# Altium schematic sheet power_supplies_HVAMP.SchDoc: HVAMP
size 420 x 297 mm; Author: G.Kasprowicz; CompanyName: WUT ISE; DrawnBy: G.Kasprowicz; Organization: WUT ISE; Address1: PW ISE; Address2: Nowowiejska 15/19 00-665 Warsaw; Address3: gkasprow@gmail.com; DocumentNumber: 4; Revision: 2; SheetNumber: 12; SheetTotal: 12; ModifiedBy: -; CheckedDate: -; Title2: Power supply; DivGrp: WUT ISE; Designer: G.Kasprowicz; ModifiedDate: -; ProjectName: Sensor Box
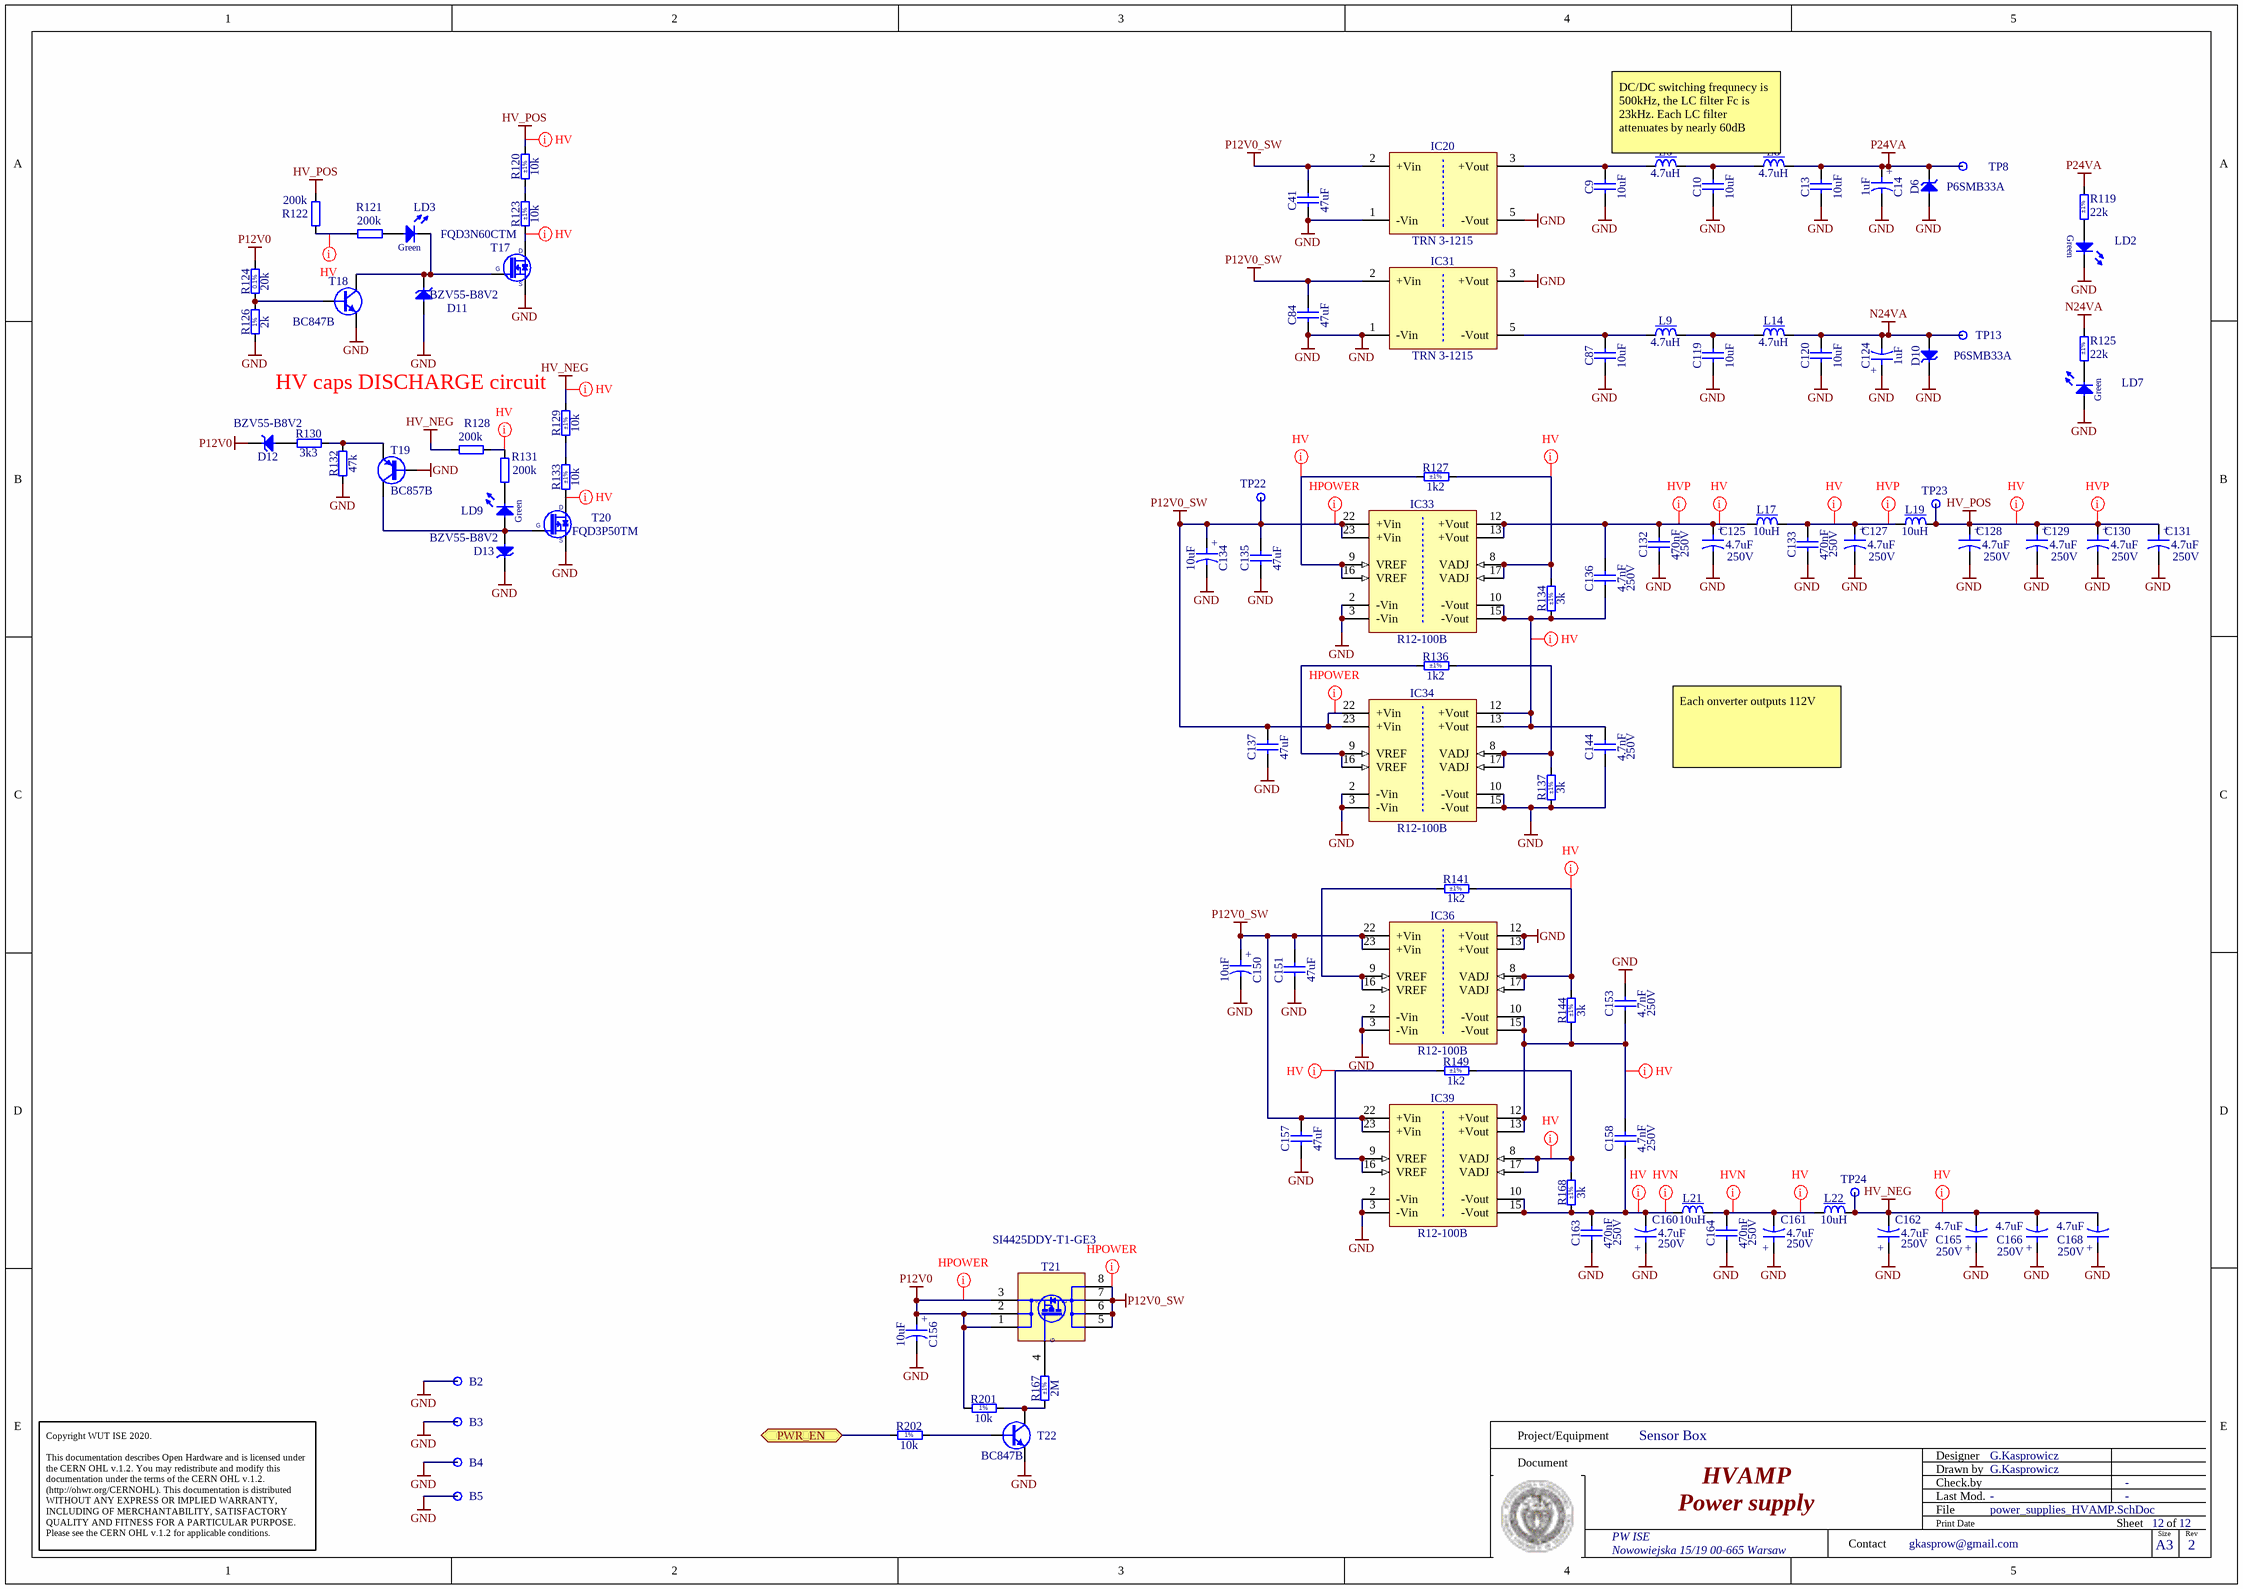
[diagram p0: power_supplies_HVAMP.SchDoc]

## Parts
B2  Plated Hole  [MTG320_700]  (value not drawn)  (no BOM)
B3  Plated Hole  [MTG320_700]  (value not drawn)  (no BOM)
B4  Plated Hole  [MTG320_700]  (value not drawn)  (no BOM)
B5  Plated Hole  [MTG320_700]  (value not drawn)  (no BOM)
C9  10uF  [CAPC2012X145N]
C10  10uF  [CAPC2012X145N]
C13  10uF  [CAPC2012X145N]
C14  1uF  [CAPMP3216X180N]
C41  47uF  [CAPC3225X270N]
C84  47uF  [CAPC3225X270N]
C87  10uF  [CAPC2012X145N]
C119  10uF  [CAPC2012X145N]
C120  10uF  [CAPC2012X145N]
C124  1uF  [CAPMP3216X180N]
C125  4.7uF  Voltage: 250V  [CAPAE9383X100M]
C127  4.7uF  Voltage: 250V  [CAPAE9383X100M]
C128  4.7uF  Voltage: 250V  [CAPAE9383X100M]
C129  4.7uF  Voltage: 250V  [CAPAE9383X100M]
C130  4.7uF  Voltage: 250V  [CAPAE9383X100M]
C131  4.7uF  Voltage: 250V  [CAPAE9383X100M]
C132  470nF  Voltage: 250V  [CAPC4532X185N]
C133  470nF  Voltage: 250V  [CAPC4532X185N]
C134  10uF  [CAPMP6032X280N]
C135  47uF  [CAPC3225X270N]
C136  4.7nF  Voltage: 250V  [CAPC2012X135N]
C137  47uF  [CAPC3225X270N]
C144  4.7nF  Voltage: 250V  [CAPC2012X135N]
C150  10uF  [CAPMP6032X280N]
C151  47uF  [CAPC3225X270N]
C153  4.7nF  Voltage: 250V  [CAPC2012X135N]
C156  10uF  [CAPMP6032X280N]
C157  47uF  [CAPC3225X270N]
C158  4.7nF  Voltage: 250V  [CAPC2012X135N]
C160  4.7uF  Voltage: 250V  [CAPAE9383X100M]
C161  4.7uF  Voltage: 250V  [CAPAE9383X100M]
C162  4.7uF  Voltage: 250V  [CAPAE9383X100M]
C163  470nF  Voltage: 250V  [CAPC4532X185N]
C164  470nF  Voltage: 250V  [CAPC4532X185N]
C165  4.7uF  Voltage: 250V  [CAPAE9383X100M]
C166  4.7uF  Voltage: 250V  [CAPAE9383X100M]
C168  4.7uF  Voltage: 250V  [CAPAE9383X100M]
D6  P6SMB33A  [DIOM5436X261N]
D10  P6SMB33A  [DIOM5436X261N]
D11  BZV55-B8V2  [DIOMELF3515N]
D12  BZV55-B8V2  [DIOMELF3515N]
D13  BZV55-B8V2  [DIOMELF3515N]
IC20  TRN 3-1215  [DCDC_TRACO_TRN3]
IC31  TRN 3-1215  [DCDC_TRACO_TRN3]
IC33  R12-100B  [DCDC_RECOM_Rxx-B]
IC34  R12-100B  [DCDC_RECOM_Rxx-B]
IC36  R12-100B  [DCDC_RECOM_Rxx-B]
IC39  R12-100B  [DCDC_RECOM_Rxx-B]
L6  4.7uH  [INDC2012X145N]
L8  4.7uH  [INDC2012X145N]
L9  4.7uH  [INDC2012X145N]
L14  4.7uH  [INDC2012X145N]
L17  10uH  [IND_MURATA-PS_8400]
L19  10uH  [IND_MURATA-PS_8400]
L21  10uH  [IND_MURATA-PS_8400]
L22  10uH  [IND_MURATA-PS_8400]
LD2  Green  [LED_KINGBRIGHT_KPH-1608CGCKr]  (value not drawn)
LD3  Green  [LED_KINGBRIGHT_KPH-1608CGCKr]  (value not drawn)
LD7  Green  [LED_KINGBRIGHT_KPH-1608CGCKr]  (value not drawn)
LD9  Green  [LED_KINGBRIGHT_KPH-1608CGCKr]  (value not drawn)
R119  22k  Tolerance: ±1%  [RESC1005X40N]
R120  10k  Tolerance: ±1%  [RESC3216X65N]
R121  200k  [RESC3216X65N]
R122  200k  [RESC3216X65N]
R123  10k  Tolerance: ±1%  [RESC3216X65N]
R124  20k  [RESC1608X55N]
R125  22k  Tolerance: ±1%  [RESC1005X40N]
R126  2k  [RESC1005X40N]
R127  1k2  Tolerance: ±1%  [RESC1608X55N]
R128  200k  [RESC3216X65N]
R129  10k  Tolerance: ±1%  [RESC3216X65N]
R130  3k3  [RESC1005X40N]
R131  200k  [RESC3216X65N]
R132  47k  [RESC1608X55N]
R133  10k  Tolerance: ±1%  [RESC3216X65N]
R134  3k  Tolerance: ±1%  [RESC1608X55N]
R136  1k2  Tolerance: ±1%  [RESC1608X55N]
R137  3k  Tolerance: ±1%  [RESC1608X55N]
R141  1k2  Tolerance: ±1%  [RESC1608X55N]
R144  3k  Tolerance: ±1%  [RESC1608X55N]
R149  1k2  Tolerance: ±1%  [RESC1608X55N]
R167  2M  Tolerance: ±1%  [RESC1005X40N]
R168  3k  Tolerance: ±1%  [RESC1608X55N]
R201  10k  [RESC1005X40N]
R202  10k  [RESC1005X40N]
T17  FQD3N60CTM  [TO228P991X239-3N-R552X520]
T18  BC847B  [SOT95P230X110-3N]
T19  BC857B  [SOT95P230X110-3N]
T20  FQD3P50TM  [TO228P991X239-3N-R552X520]
T21  SI4425DDY-T1-GE3  [SOIC127P600X175-8N]
T22  BC847B  [SOT95P230X110-3N]
TP8  Test Point  [TPS127]  (value not drawn)
TP13  Test Point  [TPS127]  (value not drawn)
TP22  Test Point  [TPS127]  (value not drawn)
TP23  Test Point  [TPS127]  (value not drawn)
TP24  Test Point  [TPS127]  (value not drawn)

## Ports
PWR_EN (bidir)

## Nets
GND: B2.1 B3.1 B4.1 B5.1 C9.1 C10.1 C13.1 C14.2 C41.1 C84.1 C87.1 C119.1 C120.1 C124.1 C125.2 C127.2 C128.2 C129.2 C130.2 C131.2 C132.1 C133.1 C134.2 C135.1 C137.1 C144.1 C150.2 C151.1 C153.2 C156.2 C157.1 C160.1 C161.1 C162.1 C163.1 C164.1 C165.1 C166.1 C168.1 D6.2(A) D10.1(C) D11.2(A) D13.1(C) IC20.1(-Vin) IC20.5(-Vout) IC31.1(-Vin) IC31.3(+Vout) IC33.2(-Vin) IC33.3(-Vin) IC34.2(-Vin) IC34.3(-Vin) IC34.10(-Vout) IC34.15(-Vout) IC36.2(-Vin) IC36.3(-Vin) IC36.12(+Vout) IC36.13(+Vout) IC39.2(-Vin) IC39.3(-Vin) LD2.1(C) LD7.2(A) R126.1 R132.1 R137.1 T17.2(S) T18.2(E) T19.1(B) T20.2(S) T22.2(E)
HV_NEG: C162.2 C165.2 C166.2 C168.2 L22.2 R128.1 R129.2 TP24.1
HV_POS: C128.1 C129.1 C130.1 C131.1 L19.2 R120.2 R122.2 TP23.1
N24VA: C120.2 C124.2 D10.2(A) L14.2 R125.2 TP13.1
P12V0: C156.1 D12.1(C) R124.2 R201.1 T21.1(S) T21.2(S) T21.3(S)
P12V0_SW: C41.2 C84.2 C134.1 C135.2 C137.2 C150.1 C151.2 C157.2 IC20.2(+Vin) IC31.2(+Vin) IC33.22(+Vin) IC33.23(+Vin) IC34.22(+Vin) IC34.23(+Vin) IC36.22(+Vin) IC36.23(+Vin) IC39.22(+Vin) IC39.23(+Vin) T21.5(D) T21.6(D) T21.7(D) T21.8(D) TP22.1
P24VA: C13.2 C14.1 D6.1(C) L8.2 R119.2 TP8.1
PWR_EN: R202.1 ; port PWR_EN
NetC9_2: C9.2 IC20.3(+Vout) L6.1
NetC10_2: C10.2 L6.2 L8.1
NetC87_2: C87.2 IC31.5(-Vout) L9.1
NetC119_2: C119.2 L9.2 L14.1
NetC125_1: C125.1 C132.2 C136.2 IC33.12(+Vout) IC33.13(+Vout) L17.1
NetC127_1: C127.1 C133.2 L17.2 L19.1
NetC136_1: C136.1 C144.2 IC33.10(-Vout) IC33.15(-Vout) IC34.12(+Vout) IC34.13(+Vout) R134.1
NetC153_1: C153.1 C158.2 IC36.10(-Vout) IC36.15(-Vout) IC39.12(+Vout) IC39.13(+Vout) R144.1
NetC158_1: C158.1 C160.2 C163.2 IC39.10(-Vout) IC39.15(-Vout) L21.1 R168.1
NetC161_2: C161.2 C164.2 L21.2 L22.1
NetD11_1: D11.1(C) LD3.1(C) T17.1(G) T18.3(C)
NetD12_2: D12.2(A) R130.1
NetD13_2: D13.2(A) LD9.2(A) T19.3(C) T20.1(G)
NetIC33_8: IC33.8(VADJ) IC33.17(VADJ) R127.2 R134.2
NetIC33_9: IC33.9(VREF) IC33.16(VREF) R127.1
NetIC34_8: IC34.8(VADJ) IC34.17(VADJ) R136.2 R137.2
NetIC34_9: IC34.9(VREF) IC34.16(VREF) R136.1
NetIC36_8: IC36.8(VADJ) IC36.17(VADJ) R141.2 R144.2
NetIC36_9: IC36.9(VREF) IC36.16(VREF) R141.1
NetIC39_8: IC39.8(VADJ) IC39.17(VADJ) R149.2 R168.2
NetIC39_9: IC39.9(VREF) IC39.16(VREF) R149.1
NetLD2_2: LD2.2(A) R119.1
NetLD3_2: LD3.2(A) R121.1
NetLD7_1: LD7.1(C) R125.1
NetLD9_1: LD9.1(C) R131.2
NetR120_1: R120.1 R123.2
NetR121_2: R121.2 R122.1
NetR123_1: R123.1 T17.3(D)
NetR124_1: R124.1 R126.2 T18.1(B)
NetR128_2: R128.2 R131.1
NetR129_1: R129.1 R133.2
NetR130_2: R130.2 R132.2 T19.2(E)
NetR133_1: R133.1 T20.3(D)
NetR167_1: R167.1 R201.2 T22.3(C)
NetR167_2: R167.2 T21.4(S)
NetR202_2: R202.2 T22.1(B)

## Layout directives
net class Hpower: P12V0, P12V0_SW
net class HV: HV_NEG, HV_POS, NetC125_1, NetC127_1, NetC136_1, NetC153_1, NetC158_1, NetC161_2, NetIC33_8, NetIC33_9, NetIC36_8, NetIC39_8, NetIC39_9, NetR121_2, NetR123_1, NetR128_2, NetR133_1
net class HVP: HV_POS, NetC125_1, NetC127_1
net class HVN: NetC158_1, NetC161_2

## Notes on the sheet
- DC/DC switching frequnecy is 500kHz, the LC filter Fc is 23kHz. Each LC filter attenuates by nearly 60dB
- (near R129) HV caps DISCHARGE circuit
- Each onverter outputs 112V
- Project/Equipment
- Document
- Designer
- Drawn by
- Check.by
- Copyright WUT ISE 2020.
  This documentation describes Open Hardware and is licensed under the CERN OHL v.1.2. You may redistribute and modify this documentation under the terms of the CERN OHL v.1.2. (http://ohwr.org/CERNOHL). This documentation is distributed WITHOUT ANY EXPRESS OR IMPLIED WARRANTY, INCLUDING OF MERCHANTABILITY, SATISFACTORY QUALITY AND FITNESS FOR A PARTICULAR PURPOSE. Please see the CERN OHL v.1.2 for applicable conditions.
- Contact
- File
- Last Mod.
- Print Date
- Sheet
- Size
- A3
- of
- Rev
- (in symbol CAP_ELECTRO_F_4.7u_250V) +
- (in symbol CTE3216-18_1UF_35V_10%) +
- (in symbol CTE6032-28_10UF_25V_10%_LESR0500) +
- (in symbol R0402_2K_1%_0.0625W_100PPM) 1%
- (in symbol R0402_10K_1%_0.0625W_100PPM) 1%
- (in symbol R0603_20K_0.1%_0.063W_10PPM) 0.1%
- (in symbol SI4425DDY-T1-GE3) G

## Library data of the parts
B2-B5 = PLATED_HOLE3.2_PAD7.0: Single Terminal Socket; Part Description: Plated Through Hole: Hole Dia.=3.2mm Pad Dia.=7.0mm; Mounted: No; Part Number: PLATED_HOLE3.2_PAD7.0; Component Type: Standard (No BOM); Pin Count: 1; Family: Plated Hole; Socket: No; SMD: No; Sense: No; Status: None; ComponentHeight: 0mm; HelpURL: Undefined; Author: CERN DEM JMW; CreateDate: 28.11.2017; LatestRevisionDate: 28.11.2017; PackageDescription: Plated Through Hole: Hole Dia.=3.2mm Pad Dia.=7.0mm
C9 C10 C13 C87 C119 C120 = CC0805_10UF_35V_10%_X5R_MURATA_GRM21BR6YA106KE43L: Non-polarised capacitor; Part Description: Chip Multilayer Ceramic Capacitor for General Purpose; Manufacturer: MURATA; Voltage: 35V; TC: X5R; Tolerance: ±10%; Part Number: CC0805_10UF_35V_10%_X5R_MURATA_GRM21BR6YA106KE43L; Component Kind: Standard; Component Type: Standard; Pin Count: 2; Value: 10uF; Status: Not Recommended; Manufacturer Part Number: GRM21BR6YA106KE43; Case: 0805; Mounted: Yes; Socket: No; SMD: Yes; Sense: No; ComponentHeight: 1.45mm; HelpURL: \\cern.ch\dfs\Applications\Altium\Datasheets\CC0805_MURATA_GRM21BR6YA106KE43L.pdf; Author: CERN DEM BC; CreateDate: 24.03.2020; LatestRevisionDate: 24.03.2020
C14 C124 = CTE3216-18_1UF_35V_10%: Polarised capacitor; Part Description: Solid Tantalum Chip Capacitor; Manufacturer: GENERIC; Manufacturer1 Part Number: TAJA105K035R; Voltage: 35V; Tolerance: ±10%; Part Number: CTE3216-18_1UF_35V_10%; Component Kind: Standard; Component Type: Standard; Pin Count: 2; Value: 1uF; Status: Preferred; Manufacturer Part Number: CTE3216-18_1UF_35V_10%; Case: A; Mounted: Yes; Socket: No; SMD: Yes; Sense: No; Manufacturer1 Example: AVX; Manufacturer1 ComponentHeight: 1.8mm; HelpURL: \\cern.ch\dfs\Applications\Altium\Datasheets\CTE_AVX_TAJ.pdf; Author: CERN DEM JLC; CreateDate: 03.12.2007; LatestRevisionDate: 03.12.2007
C41 C84 C135 C137 C151 C157 = CC1210_47UF_16V_20%_X5R: Non-polarised capacitor; Part Description: SMD Multilayer Chip Ceramic Capacitor; Manufacturer: GENERIC; Manufacturer1 Part Number: EMK325BJ476MM-T; Voltage: 16V; TC: X5R; Tolerance: ±20%; Part Number: CC1210_47UF_16V_20%_X5R; Component Kind: Standard; Component Type: Standard; Pin Count: 2; Value: 47uF; Status: None; Manufacturer Part Number: CC1210_47UF_16V_20%_X5R; Case: 1210; Mounted: Yes; Socket: No; SMD: Yes; Sense: No; Manufacturer1 Example: TAIYO YUDEN; Manufacturer1 ComponentHeight: 2.7mm; HelpURL: \\cern.ch\dfs\Applications\Altium\Datasheets\CC1210_X5R_TAIYO-YUDEN_HIGH-VALUE.pdf; Author: CERN DEM MR; CreateDate: 03.02.2016; LatestRevisionDate: 03.02.2016
C125 C127-C131 C160-C162 C165 C166 C168 = CAP_ELECTRO_F_4.7u_250V: Electrolytic capacitor 4.7uF 250V; Part Number: CAE800-1000_4.7UF_250V_20%; Part Description: Aluminum Electrolytic SMT Capacitor; Manufacturer: Nichicon; Manufacturer Part Number: UUX2E4R7MNL1GS; Tolerance: ±20%; Component Kind: Standard; Component Type: Standard; Pin Count: 2; Value: 4.7uF; Status: Recommended; Case: F; Mounted: Yes; Socket: No; SMD: Yes; Sense: No; ComponentHeight: 10.2mm; HelpURL: \\cern.ch\dfs\Applications\Altium\Datasheets\CAE_PANASONIC_FK.pdf; Author: GK; CreateDate: 03.12.2007; LatestRevisionDate: 05.11.2014
C132 C133 C163 C164 = CC1812_470NF_250V_10%_X7R_FT-CAP: Non-polarised capacitor; Part Description: Flexible Termination System (FT-CAP) SMD Multilayer Ceramic  Chip Capacitor; Manufacturer: KEMET; Manufacturer Part Number: C1812X474KARACTU; TC: X7R; Tolerance: ±10%; Part Number: CC1812_470NF_250V_10%_X7R_FT-CAP; Component Kind: Standard; Component Type: Standard; Pin Count: 2; Value: 470nF; Status: None; Case: 1812; Mounted: Yes; Socket: No; SMD: Yes; Sense: No; ComponentHeight: 1.85mm; HelpURL: \\cern.ch\dfs\Applications\Altium\Datasheets\CC1812_X7R_KEMET_FT-CAP.pdf; Author: CERN DEM JLC; CreateDate: 15.09.2014; LatestRevisionDate: 15.09.2014
C134 C150 C156 = CTE6032-28_10UF_25V_10%_LESR0500: Polarised capacitor; Part Description: Low ESR 0R5 Solid Tantalum Chip Capacitor; Manufacturer: GENERIC; Manufacturer1 Part Number: TPSC106K025R0500; Voltage: 25V; Tolerance: ±10%; Part Number: CTE6032-28_10UF_25V_10%_LESR0500; Component Kind: Standard; Component Type: Standard; Pin Count: 2; Value: 10uF; Status: Preferred; Manufacturer Part Number: CTE6032-28_10UF_25V_10%_LESR0500; Case: C; Mounted: Yes; Socket: No; SMD: Yes; Sense: No; Manufacturer1 Example: AVX; Manufacturer1 ComponentHeight: 2.8mm; HelpURL: \\cern.ch\dfs\Applications\Altium\Datasheets\CTE-LESR_AVX_TPS.pdf; Author: CERN DEM JLC; CreateDate: 05/05/2008; LatestRevisionDate: 20/01/2009
C136 C144 C153 C158 = CC0805_4.7NF_250V_10%_X7R: Non-polarised capacitor; Part Description: SMD Multilayer Chip Ceramic Capacitor; Manufacturer: GENERIC; Manufacturer1 Part Number: CC0805KRX7RYBB472; TC: X7R; Tolerance: ±10%; Part Number: CC0805_4.7NF_250V_10%_X7R; Component Kind: Standard; Component Type: Standard; Pin Count: 2; Value: 4.7nF; Status: None; Manufacturer Part Number: CC0805_4.7NF_250V_10%_X7R; Case: 0805; Mounted: Yes; Socket: No; SMD: Yes; Sense: No; Manufacturer1 Example: YAGEO PHYCOMP; Manufacturer1 ComponentHeight: 1.45mm; HelpURL: \\cern.ch\dfs\Applications\Altium\Datasheets\CC0805_NP0X7R_MID-VOLTAGE_100-to-630V.pdf; Author: CERN DEM MR; CreateDate: 16.02.2016; LatestRevisionDate: 16.02.2016
D6 D10 = P6SMB33A: Transient Voltage Suppressor Diode (Uni-Directional); Part Description: Uni-directional Transient Voltage Suppressor (TVS) Diode; Manufacturer: LITTELFUSE; Voltage: 33V; Power: 600W; PressFit: No; Bonding: No; Part Number: P6SMB33A; Component Kind: Standard; Component Type: Standard; Device: P6SMB33A; PackageDescription: DO-214-AA/SMB Diode, Molded Body; 5.40mm L X 3.62mm W X 2.61mm H, IPC Medium Density; Manufacturer Part Number: P6SMB33A; Pin Count: 2; Case: SMB; Mounted: Yes; Socket: No; SMD: Yes; Sense: No; ComponentHeight: 2.61mm; HelpURL: \\cern.ch\dfs\Applications\Altium\Datasheets\P6SMB33A.pdf; Author: CERN DEM JLC; CreateDate: 25.02.2019; LatestRevisionDate: 25.02.2019
D11-D13 = BZV55-B8V2: Zener Diode; Part Description: Voltage Regulator Diode; Manufacturer: NEXPERIA; Voltage: 8V2; Power: 500mW; PressFit: No; Bonding: No; Part Number: BZV55-B8V2; Component Kind: Standard; Component Type: Standard; Device: BZV55-B8V2; PackageDescription: SOD80C, MELF Diode, 2-Leads, Body 3.5x1.5mm, IPC Medium Density; Manufacturer Part Number: BZV55-B8V2; Pin Count: 2; Case: SOD-80C; Mounted: Yes; Socket: No; SMD: Yes; Sense: No; ComponentHeight: 1.6mm; HelpURL: \\cern.ch\dfs\Applications\Altium\Datasheets\BZV55.pdf; Author: CERN DEM JLC; CreateDate: 06.05.2008; LatestRevisionDate: 22.01.2018
IC20 IC31 = DCDC_TRACO_TRN 3-0515: 9-18V DC to 24V, Iout (max) 125mA, 3W DC-DC Converter; Part Description: 18-36VDC to 24V, Iout (max) 125mA, 3W DC-DC Converter; Manufacturer: TRACO POWER; PressFit: No; Bonding: No; Part Number: TRN 3-1215; Component Kind: Standard; Component Type: Standard; Device: TRN 3-1215; PackageDescription: TRN 3 Series , Body 11.9 x 7.7mm; Manufacturer Part Number: TRN 3-1215; Pin Count: 5; Mounted: Yes; Socket: No; SMD: No; Sense: No; ComponentHeight: 11.5mm; HelpURL: \\cern.ch\dfs\Applications\Altium\Datasheets\TRN 3-2411.pdf; Author: GK; CreateDate: 14.06.2018; LatestRevisionDate: 14.06.2018
IC33 IC34 IC36 IC39 = R12-100B: RECOM, Rxx-B Series, Single Output DCDC Converter; Part Description: 10-14VDC to 50-135VDC, 3kVDC Isolated, 5W DC-DC Converter; PressFit: No; Bonding: No; Part Number: R12-100B; Component Kind: Standard; Component Type: Standard; Device: R12-100B; PackageDescription: Rxx-B Series, Body 31.8x20.3mm, DIP24 Package; Manufacturer: RECOM; Manufacturer Part Number: R12-100B; Pin Count: 12; Mounted: Yes; Socket: No; SMD: No; Sense: No; ComponentHeight: 9.9mm; HelpURL: \\cern.ch\dfs\Applications\Altium\Datasheets\R12-100B.pdf; Author: CERN DEM MR; CreateDate: 29.08.2019; LatestRevisionDate: 29.08.2019
L6 L8 L9 L14 = IND0805_4.7UH_20%_TAIYO-YUDEN_CB: Inductor With Core; Part Description: Wound Chip Power Inductors (CB Series); Manufacturer: TAIYO YUDEN; Manufacturer Part Number: CB2012T4R7M; Power: 300mA; Resistance: 0.4R; Tolerance: ±20%; Part Number: IND0805_4.7UH_20%_TAIYO-YUDEN_CB; Component Kind: Standard; Component Type: Standard; Pin Count: 2; Value: 4.7uH; Status: None; Case: 0805; Mounted: Yes; Socket: No; SMD: Yes; Sense: No; ComponentHeight: 1.45mm; HelpURL: \\cern.ch\dfs\Applications\Altium\Datasheets\IND0805_TAIYO-YUDEN_CB.pdf; Author: CERN DEM JLC; CreateDate: 15.11.2010; LatestRevisionDate: 15.11.2010
L17 L19 L21 L22 = IND_10UH_10%_MURATA-PS_8400: Inductor With Core; Part Description: Miniature Surface Mount Power Inductor (8400 Serie); Manufacturer: MURATA POWER SOLUTIONS; Manufacturer Part Number: 84103C; Power: 950mA; Resistance: 0.24R; Tolerance: ±10%; Part Number: IND_10UH_10%_MURATA-PS_8400; Component Kind: Standard; Component Type: Standard; Pin Count: 2; Value: 10uH; Status: None; Mounted: Yes; Socket: No; SMD: Yes; Sense: No; ComponentHeight: 2.9mm; HelpURL: \\cern.ch\dfs\Applications\Altium\Datasheets\IND_MURATA-PS_8400.pdf; Author: CERN DEM JLC; CreateDate: 02.07.2012; LatestRevisionDate: 02.07.2012
LD2 LD3 LD7 LD9 = LED_0603_Green: Green 0603; Part Number: LED_KINGBRIGHT_KPH-1608CGCK; Part Description: SMD Green LED, Case 1.6mmX0.8mm(0603), 0.65mm Thickness; Manufacturer: KINGBRIGHT; Manufacturer Part Number: KPH-1608CGCK; PressFit: No; Bonding: No; Component Kind: Standard; Component Type: Standard; Color: Green; Footprint: LED_KINGBRIGHT_KPH-1608CGCK; PackageDescription: SMT Green LED, Case 0603, Body L 1.6 x W 0.8mm H 0.65mm; Pin Count: 2; Mounted: Yes; Socket: No; SMD: Yes; Sense: No; ComponentHeight: 0.65mm; HelpURL: \\cern.ch\dfs\Applications\Altium\Datasheets\LED_KINGBRIGHT_KPH-1608CGCK.pdf; Author: CERN DEM JLC; CreateDate: 03.07.2017; LatestRevisionDate: 03.07.2017
R119 R125 = R0402_22K_1%_0.0625W_100PPM: Resistor - 1%; Part Description: General Purpose Thick Film Chip Resistor; Manufacturer: GENERIC; Manufacturer1 Part Number: 232270672203L; TC: ±100ppm/°C; PressFit: No; Part Number: R0402_22K_1%_0.0625W_100PPM; Component Kind: Standard; Component Type: Standard; Pin Count: 2; Value: 22k; Status: Not Recommended; Power: 0.0625W; Manufacturer Part Number: R0402_22K_1%_0.0625W_100PPM; Case: 0402; Mounted: Yes; Sense: No; Socket: No; SMD: Yes; Manufacturer1 Example: YAGEO PHYCOMP; Manufacturer1 ComponentHeight: 0.4mm; HelpURL: \\cern.ch\dfs\Applications\Altium\Datasheets\R0402_Phycomp_RC0402.pdf; Author: CERN DEM JLC; CreateDate: 03.12.2007; LatestRevisionDate: 17.10.2012
R120 R123 R129 R133 = R1206_10K_1%_0.25W_100PPM: Resistor - 1%; Part Description: General Purpose Thick Film Chip Resistor; Manufacturer: GENERIC; Manufacturer1 Part Number: NRC12F1002TRF; Power: 0.25W; TC: ±100ppm/°C; PressFit: No; Part Number: R1206_10K_1%_0.25W_100PPM; Component Kind: Standard; Component Type: Standard; Pin Count: 2; Value: 10k; Status: Preferred; Manufacturer Part Number: R1206_10K_1%_0.25W_100PPM; Case: 1206; Mounted: Yes; Sense: No; Socket: No; SMD: Yes; Manufacturer1 Example: NIC COMPONENT; Manufacturer1 ComponentHeight: 0.65mm; HelpURL: \\cern.ch\dfs\Applications\Altium\Datasheets\R1206_NIC_NRC.pdf; Author: CERN DEM JLC; CreateDate: 03.12.2007; LatestRevisionDate: 13.03.2008
R121 R122 R128 R131 = R1206_200K_1%_0.25W_100PPM: Resistor - 1%; Part Description: General Purpose Thick Film Chip Resistor; Manufacturer: GENERIC; Manufacturer1 Part Number: NRC12F2003TRF; Power: 0.25W; TC: ±100ppm/°C; PressFit: No; Part Number: R1206_200K_1%_0.25W_100PPM; Component Kind: Standard; Component Type: Standard; Pin Count: 2; Value: 200k; Status: Preferred; Tolerance: ±1%; Manufacturer Part Number: R1206_200K_1%_0.25W_100PPM; Case: 1206; Mounted: Yes; Sense: No; Socket: No; SMD: Yes; Manufacturer1 Example: NIC COMPONENT; Manufacturer1 ComponentHeight: 0.65mm; HelpURL: \\cern.ch\dfs\Applications\Altium\Datasheets\R1206_NIC_NRC.pdf; Author: CERN DEM JLC; CreateDate: 03.12.2007; LatestRevisionDate: 13.03.2008
R124 = R0603_20K_0.1%_0.063W_10PPM: Resistor - 0.1%; Part Description: Thin Film Chip Resistor; Manufacturer: GENERIC; Manufacturer1 Part Number: RN73C1J20KBTDF; Power: 0.063W; TC: ±10ppm; PressFit: No; Part Number: R0603_20K_0.1%_0.063W_10PPM; Component Kind: Standard; Component Type: Standard; Pin Count: 2; Value: 20k; Status: Not Recommended; Tolerance: ±0.1%; Manufacturer Part Number: R0603_20K_0.1%_0.063W_10PPM; Case: 0603; Mounted: Yes; Sense: No; Socket: No; SMD: Yes; Manufacturer1 Example: TYCO HOLSWORTHY; Manufacturer1 ComponentHeight: 0.5mm; HelpURL: \\cern.ch\dfs\Applications\Altium\Datasheets\R0603_Tyco_RN73.pdf; Author: CERN DEM JLC; CreateDate: 03.12.2007; LatestRevisionDate: 13.03.2008
R126 = R0402_2K_1%_0.0625W_100PPM: Resistor - 1%; Part Description: General Purpose Thick Film Chip Resistor; Manufacturer: GENERIC; Manufacturer1 Part Number: 232270672002L; TC: ±100ppm/°C; PressFit: No; Part Number: R0402_2K_1%_0.0625W_100PPM; Component Kind: Standard; Component Type: Standard; Pin Count: 2; Value: 2k; Status: Not Recommended; Power: 0.0625W; Tolerance: ±1%; Manufacturer Part Number: R0402_2K_1%_0.0625W_100PPM; Case: 0402; Mounted: Yes; Sense: No; Socket: No; SMD: Yes; Manufacturer1 Example: YAGEO PHYCOMP; Manufacturer1 ComponentHeight: 0.4mm; HelpURL: \\cern.ch\dfs\Applications\Altium\Datasheets\R0402_Phycomp_RC0402.pdf; Author: CERN DEM JLC; CreateDate: 03.12.2007; LatestRevisionDate: 17.10.2012
R127 R136 R141 R149 = R0603_1K2_1%_0.1W_100PPM: Resistor - 1%; Part Description: General Purpose Thick Film Chip Resistor; Manufacturer: GENERIC; Manufacturer1 Part Number: NRC06F1201TRF; Power: 0.1W; TC: ±100ppm/°C; PressFit: No; Part Number: R0603_1K2_1%_0.1W_100PPM; Component Kind: Standard; Component Type: Standard; Pin Count: 2; Value: 1k2; Status: Preferred; Manufacturer Part Number: R0603_1K2_1%_0.1W_100PPM; Case: 0603; Mounted: Yes; Sense: No; Socket: No; SMD: Yes; Manufacturer1 Example: NIC COMPONENT; Manufacturer1 ComponentHeight: 0.55mm; HelpURL: \\cern.ch\dfs\Applications\Altium\Datasheets\R0603_NIC_NRC.pdf; Author: CERN DEM JLC; CreateDate: 03.12.2007; LatestRevisionDate: 13.03.2008
R130 = R0402_3K3_1%_0.0625W_100PPM: Resistor - 1%; Part Description: General Purpose Thick Film Chip Resistor; Manufacturer: GENERIC; Manufacturer1 Part Number: 232270673302L; TC: ±100ppm/°C; PressFit: No; Part Number: R0402_3K3_1%_0.0625W_100PPM; Component Kind: Standard; Component Type: Standard; Pin Count: 2; Value: 3k3; Status: Not Recommended; Power: 0.0625W; Tolerance: ±1%; Manufacturer Part Number: R0402_3K3_1%_0.0625W_100PPM; Case: 0402; Mounted: Yes; Sense: No; Socket: No; SMD: Yes; Manufacturer1 Example: YAGEO PHYCOMP; Manufacturer1 ComponentHeight: 0.4mm; HelpURL: \\cern.ch\dfs\Applications\Altium\Datasheets\R0402_Phycomp_RC0402.pdf; Author: CERN DEM JLC; CreateDate: 03.12.2007; LatestRevisionDate: 17.10.2012
R132 = R0603_47K_1%_0.1W_100PPM: Resistor - 1%; Part Description: General Purpose Thick Film Chip Resistor; Manufacturer: GENERIC; Manufacturer1 Part Number: NRC06F4702TRF; Power: 0.1W; TC: ±100ppm/°C; PressFit: No; Part Number: R0603_47K_1%_0.1W_100PPM; Component Kind: Standard; Component Type: Standard; Pin Count: 2; Value: 47k; Status: Preferred; Tolerance: ±1%; Manufacturer Part Number: R0603_47K_1%_0.1W_100PPM; Case: 0603; Mounted: Yes; Sense: No; Socket: No; SMD: Yes; Manufacturer1 Example: NIC COMPONENT; Manufacturer1 ComponentHeight: 0.55mm; HelpURL: \\cern.ch\dfs\Applications\Altium\Datasheets\R0603_NIC_NRC.pdf; Author: CERN DEM JLC; CreateDate: 03.12.2007; LatestRevisionDate: 13.03.2008
R134 R137 R144 R168 = R0603_3k_1%_0.1W_100PPM: Resistor - 1%; Part Description: General Purpose Thick Film Chip Resistor; Manufacturer: GENERIC; Manufacturer1 Part Number: NRC06F3001TRF; Power: 0.1W; TC: ±100ppm/°C; PressFit: No; Part Number: R0603_3K_1%_0.1W_100PPM; Component Kind: Standard; Component Type: Standard; Pin Count: 2; Value: 3k; Status: Preferred; Manufacturer Part Number: R0603_3K_1%_0.1W_100PPM; Case: 0603; Mounted: Yes; Sense: No; Socket: No; SMD: Yes; Manufacturer1 Example: NIC COMPONENT; Manufacturer1 ComponentHeight: 0.55mm; HelpURL: \\cern.ch\dfs\Applications\Altium\Datasheets\R0603_NIC_NRC.pdf; Author: CERN DEM JLC; CreateDate: 03.12.2007; LatestRevisionDate: 13.03.2008
R167 = R0402_2M_1%_0.0625W_100PPM: Resistor - 1%; Part Description: General Purpose Thick Film Chip Resistor; Manufacturer: GENERIC; Manufacturer1 Part Number: 232270672005L; TC: ±100ppm/°C; PressFit: No; Part Number: R0402_2M_1%_0.0625W_100PPM; Component Kind: Standard; Component Type: Standard; Pin Count: 2; Value: 2M; Status: Not Recommended; Power: 0.0625W; Manufacturer Part Number: R0402_2M_1%_0.0625W_100PPM; Case: 0402; Mounted: Yes; Sense: No; Socket: No; SMD: Yes; Manufacturer1 Example: YAGEO PHYCOMP; Manufacturer1 ComponentHeight: 0.4mm; HelpURL: \\cern.ch\dfs\Applications\Altium\Datasheets\R0402_Phycomp_RC0402.pdf; Author: CERN DEM JLC; CreateDate: 03.12.2007; LatestRevisionDate: 17.10.2012
R201 R202 = R0402_10K_1%_0.0625W_100PPM: Resistor - 1%; Part Description: General Purpose Thick Film Chip Resistor; Manufacturer: GENERIC; Manufacturer1 Part Number: 232270671003L; TC: ±100ppm/°C; PressFit: No; Part Number: R0402_10K_1%_0.0625W_100PPM; Component Kind: Standard; Component Type: Standard; Pin Count: 2; Value: 10k; Status: Not Recommended; Power: 0.0625W; Tolerance: ±1%; Manufacturer Part Number: R0402_10K_1%_0.0625W_100PPM; Case: 0402; Mounted: Yes; Sense: No; Socket: No; SMD: Yes; Manufacturer1 Example: YAGEO PHYCOMP; Manufacturer1 ComponentHeight: 0.4mm; HelpURL: \\cern.ch\dfs\Applications\Altium\Datasheets\R0402_Phycomp_RC0402.pdf; Author: CERN DEM JLC; CreateDate: 03.12.2007; LatestRevisionDate: 17.10.2012
T17 = Q_FQD3N60CTM: N-CHANNEL 600V, 2.4A, 3.4Ohm; Part Description: 600V 2.4A N-Channel Power MOSFET; Manufacturer: ONSEMI; PressFit: No; Bonding: No; Part Number: FQD3N60CTM; Component Kind: Standard; Component Type: Standard; Device: FQD3N60CTM; PackageDescription: TO-252AA DPAK TO, 2.28mm pitch; 2 pin,9.905mm L X 6.095mm W X 2.39mm H body, IPC Medium Density; Manufacturer Part Number: FQD3N60CTM; Pin Count: 3; Case: DPAK; Mounted: Yes; Socket: No; SMD: Yes; Sense: No; ComponentHeight: 2.38mm; HelpURL: \\cern.ch\dfs\Applications\Altium\Datasheets\IRFR224PBF.pdf; Author: GK; CreateDate: 25.07.2012; LatestRevisionDate: 25.07.2012
T18 T22 = BC847B: NPN Transistor; Part Description: 45V 100mA NPN general-purpose transistors; Manufacturer: NXP SEMICONDUCTORS; PressFit: No; Bonding: No; Part Number: BC847B; Component Kind: Standard; Component Type: Standard; Device: BC847B; PackageDescription: SOT23, 3 pin, Pitch 0.95mm - 1.3mm W X 2.9mm L X 1.1mm H, IPC Medium Density; Manufacturer Part Number: BC847B; Pin Count: 3; Case: SOT23-3; Mounted: Yes; Socket: No; SMD: Yes; Sense: No; ComponentHeight: 1.1mm; HelpURL: \\cern.ch\dfs\Applications\Altium\Datasheets\BC847B.pdf; Author: CERN DEM JLC; CreateDate: 14.06.2011; LatestRevisionDate: 14.06.2011
T19 = BC857B: PNP Transistor; Part Description: 45V 100mA PNP general-purpose transistors; Manufacturer: NXP SEMICONDUCTORS; PressFit: No; Bonding: No; Part Number: BC857B; Component Kind: Standard; Component Type: Standard; Device: BC857B; PackageDescription: SOT23, 3 pin, Pitch 0.95mm - 1.3mm W X 2.9mm L X 1.1mm H, IPC Medium Density; Manufacturer Part Number: BC857B; Pin Count: 3; Case: SOT23-3; Mounted: Yes; Socket: No; SMD: Yes; Sense: No; ComponentHeight: 1.1mm; HelpURL: \\cern.ch\dfs\Applications\Altium\Datasheets\BC857B.pdf; Author: CERN DEM JLC; CreateDate: 14.06.2011; LatestRevisionDate: 14.06.2011
T20 = Q_FQD3P50TM: P-CHANNEL -500V, -2.1A 4.9Ohm; Part Description: -500V -2.1A P-Channel Power MOSFET; Manufacturer: ONSEMI; PressFit: No; Bonding: No; Part Number: FQD3P50TM; Component Kind: Standard; Component Type: Standard; Device: FQD3P50TM; PackageDescription: TO-252AA DPAK TO, 2.28mm pitch; 2 pin,9.905mm L X 6.095mm W X 2.39mm H body, IPC Medium Density; Manufacturer Part Number: FQD3P50TM; Pin Count: 3; Case: DPAK; Mounted: Yes; Socket: No; SMD: Yes; Sense: No; ComponentHeight: 2.38mm; HelpURL: \\cern.ch\dfs\Applications\Altium\Datasheets\IRFR9220PBF.pdf; Author: GK; CreateDate: 18.03.2013; LatestRevisionDate: 18.03.2013
T21 = SI4425DDY-T1-GE3: -30V -19.7A P-Channel MOSFET; Manufacturer: VISHAY SILICONIX; PressFit: No; Bonding: No; Part Number: SI4425DDY-T1-GE3; Component Kind: Standard; Component Type: Standard; Device: SI4425DDY-T1-GE3; PackageDescription: SOIC 8, Pitch 1.27mm - Body 4x5mm, IPC Medium Density; Part Description: -30V -19.7A P-Channel MOSFET; Manufacturer Part Number: SI4425DDY-T1-GE3; Pin Count: 8; Case: SOIC8; Mounted: Yes; Socket: No; SMD: Yes; Sense: No; ComponentHeight: 1.75mm; HelpURL: \\cern.ch\dfs\Applications\Altium\Datasheets\SI4425DDY-T1-GE3.pdf; Author: CERN DEM MR; CreateDate: 05/10/2016; LatestRevisionDate: 05/10/2016
TP8 TP13 TP22-TP24 = SMD_PAD_1.27X1.27MM: Part Description: 1.27mm x 1.27mm PCB Copper Area (SMD Test Point); Mounted: No; Part Number: SMD_PAD_1.27X1.27MM; Component Kind: Standard (No BOM); Component Type: Standard (No BOM); Pin Count: 1; Family: Test Point; Socket: No; SMD: Yes; Sense: No; Status: None; ComponentHeight: 0mm; HelpURL: Undefined; Author: CERN DEM JLC; CreateDate: 12/01/2008; LatestRevisionDate: 12/01/2008; PackageDescription: 1.27mm x 1.27mm PCB Copper Area (SMD Test Point)